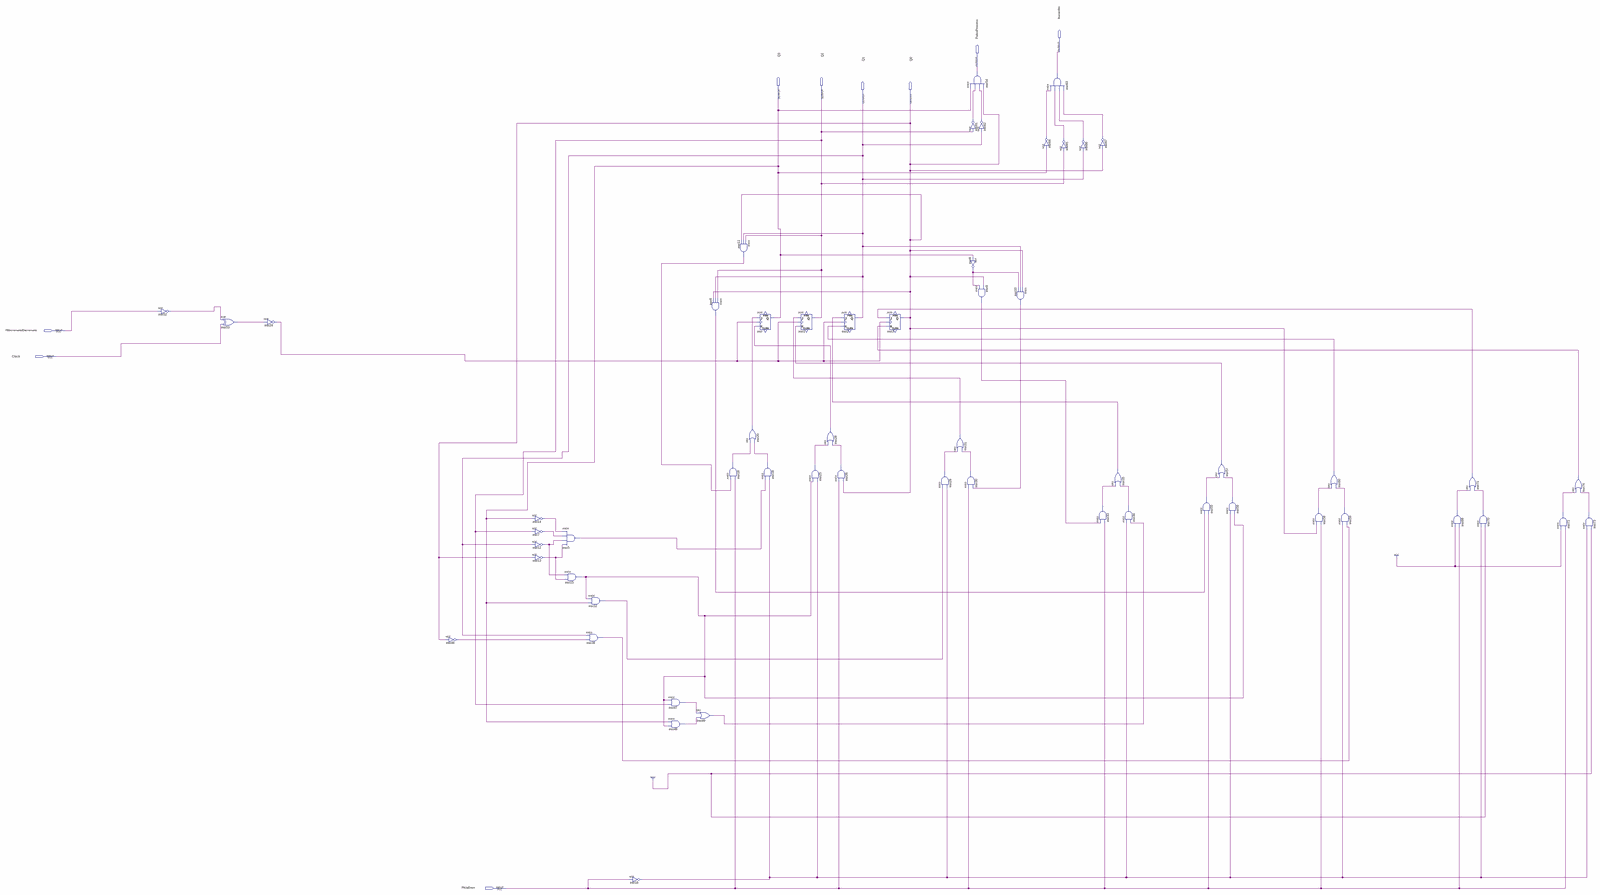
[diagram p0: schematic sheet, whole]
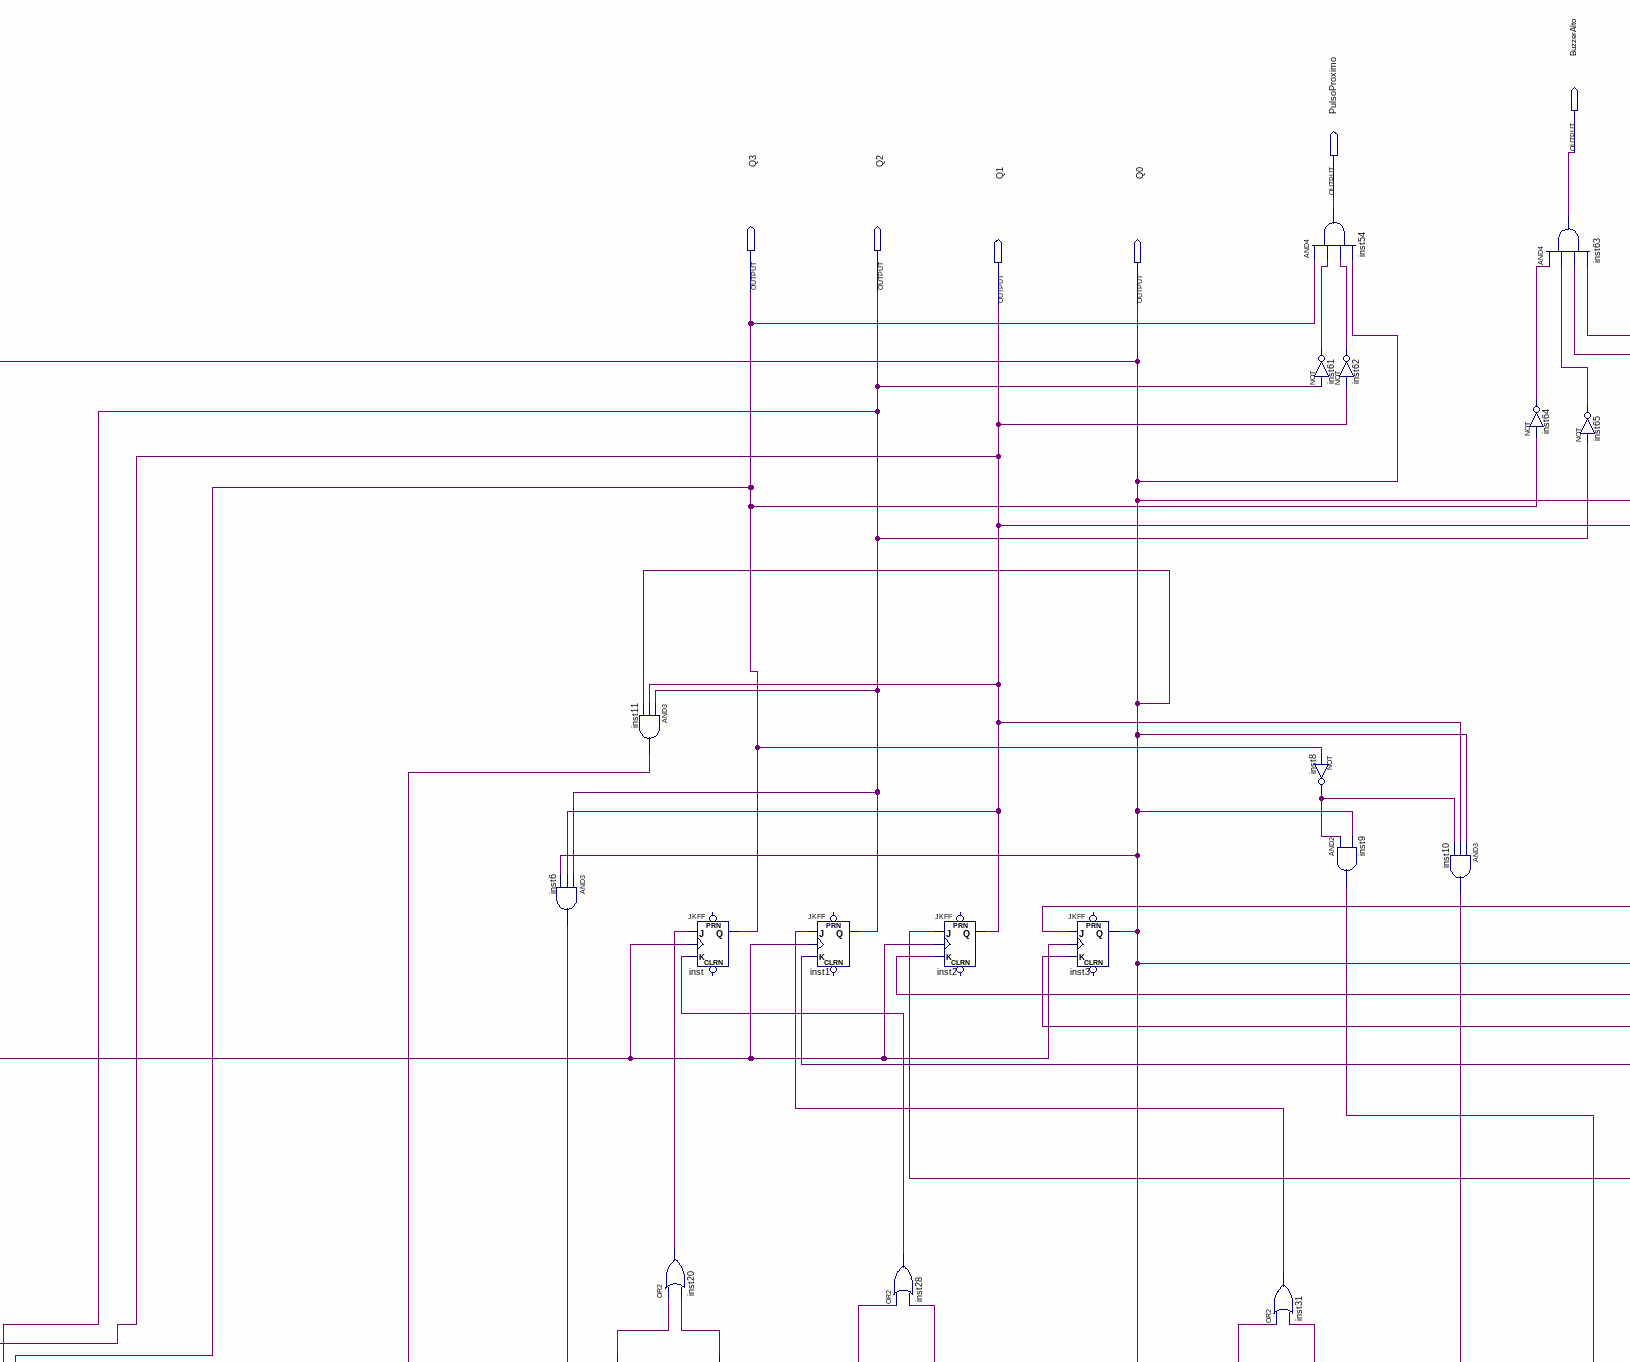
[diagram p1: schematic sheet, upper centre part]
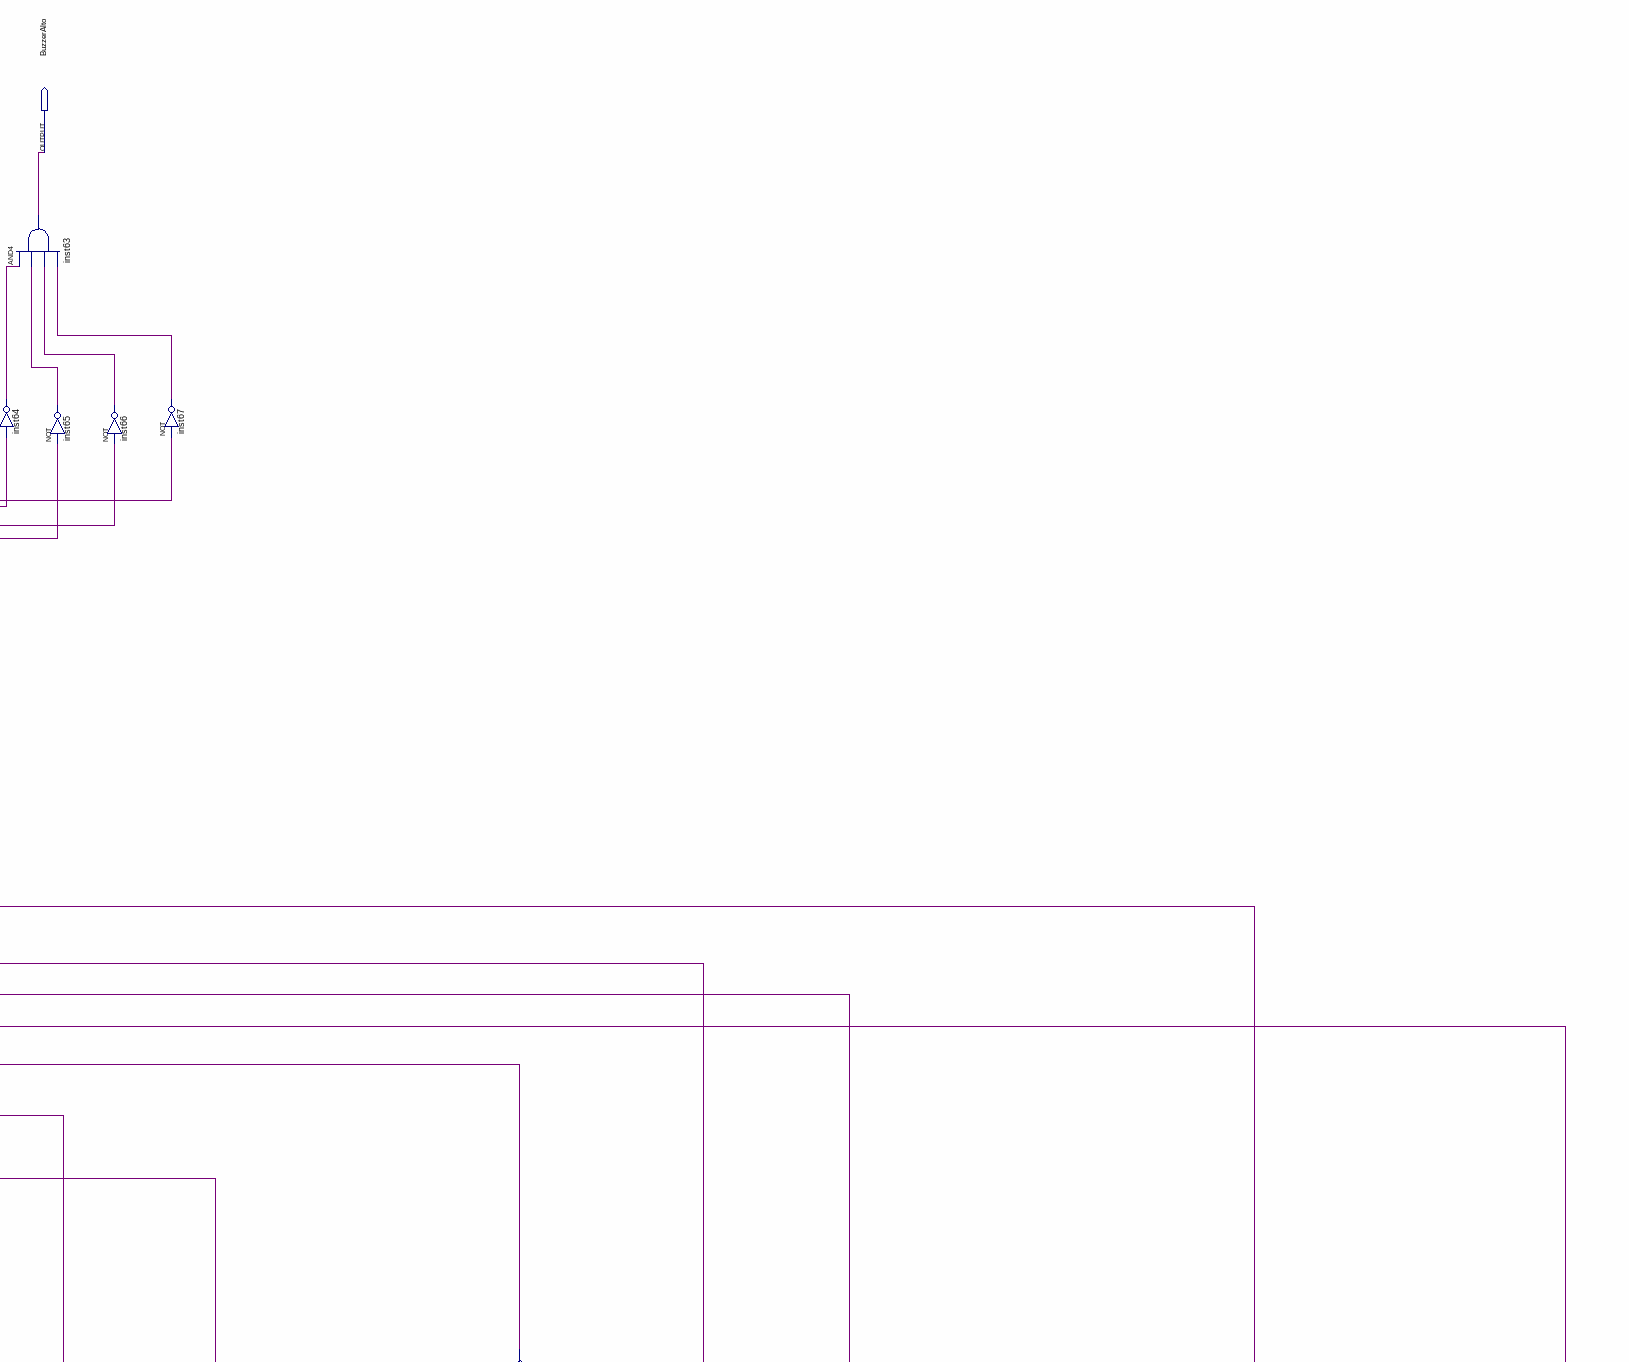
[diagram p2: schematic sheet, upper right part]
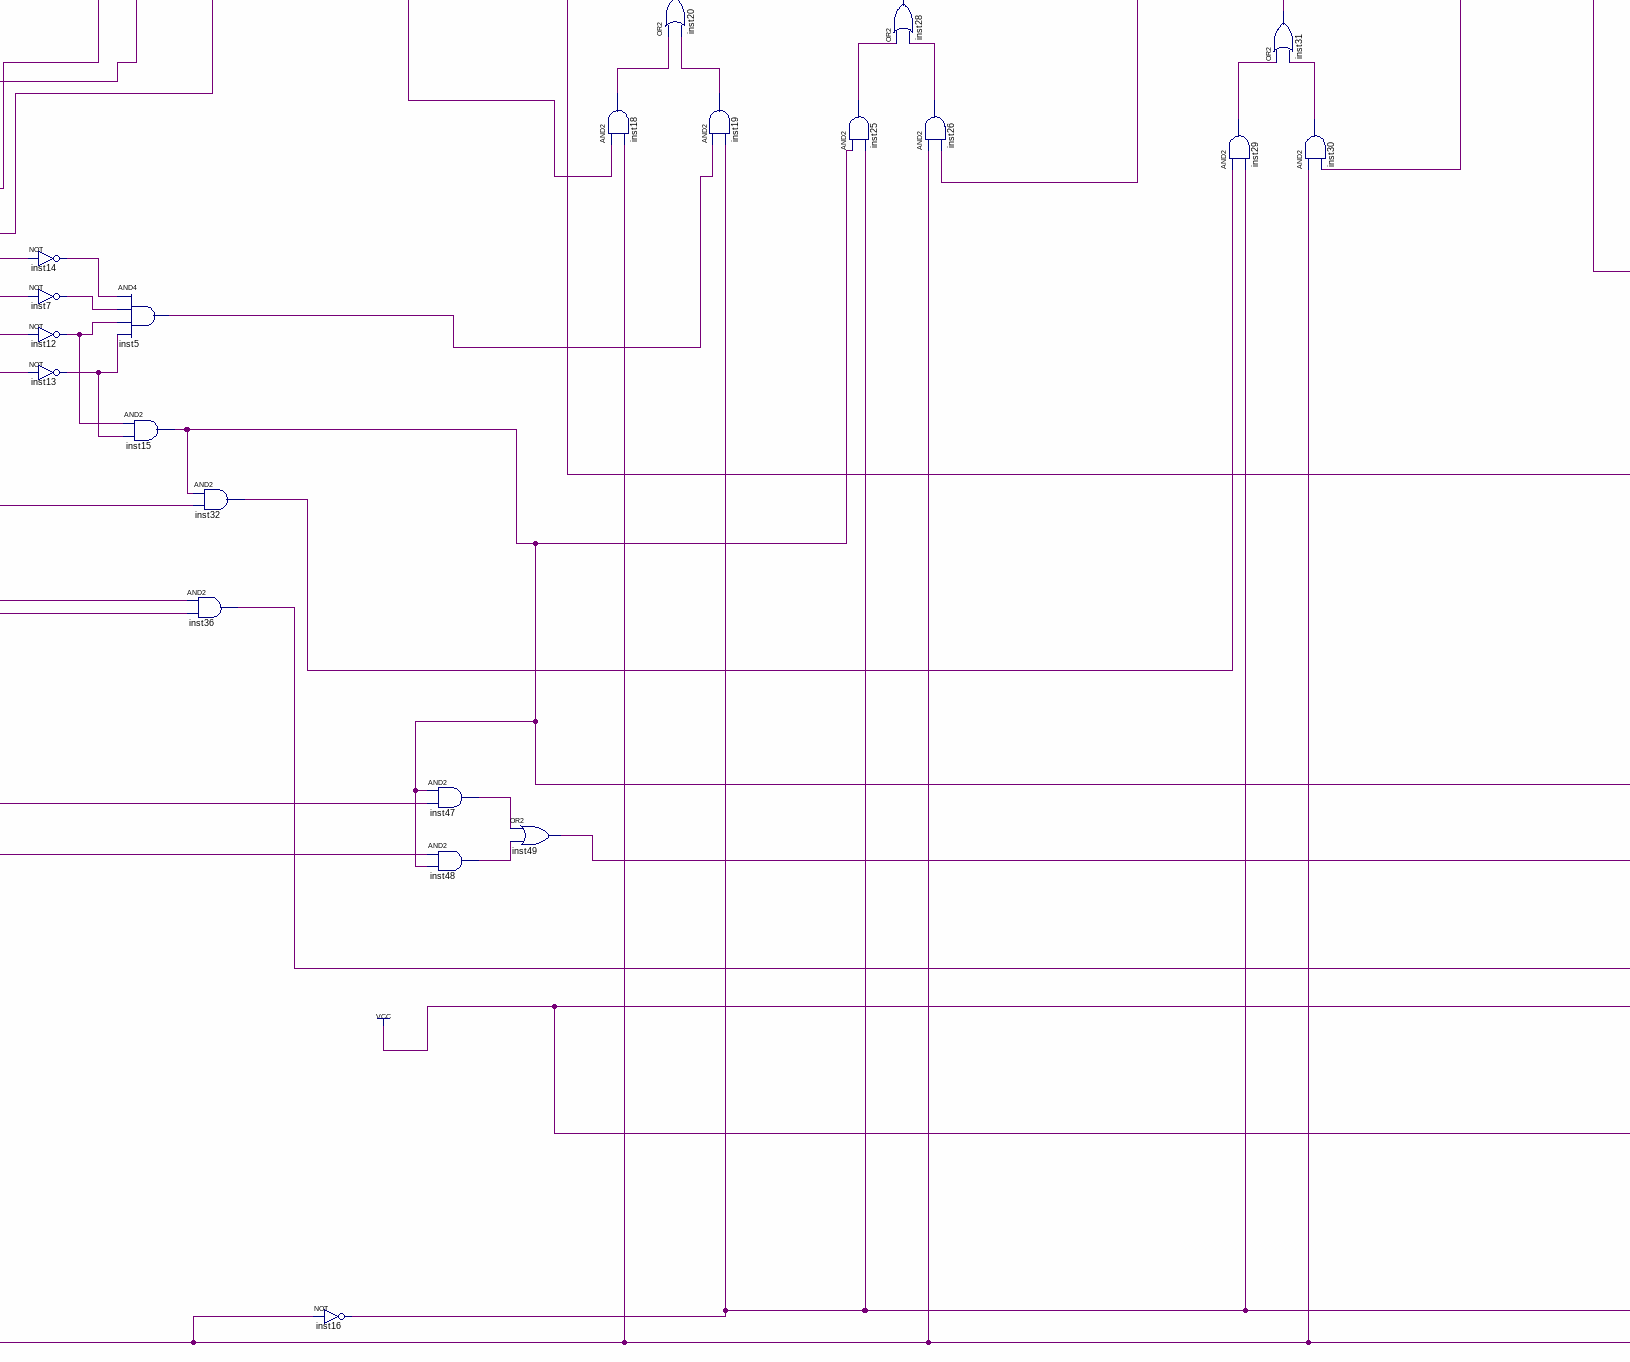
[diagram p3: schematic sheet, lower centre part]
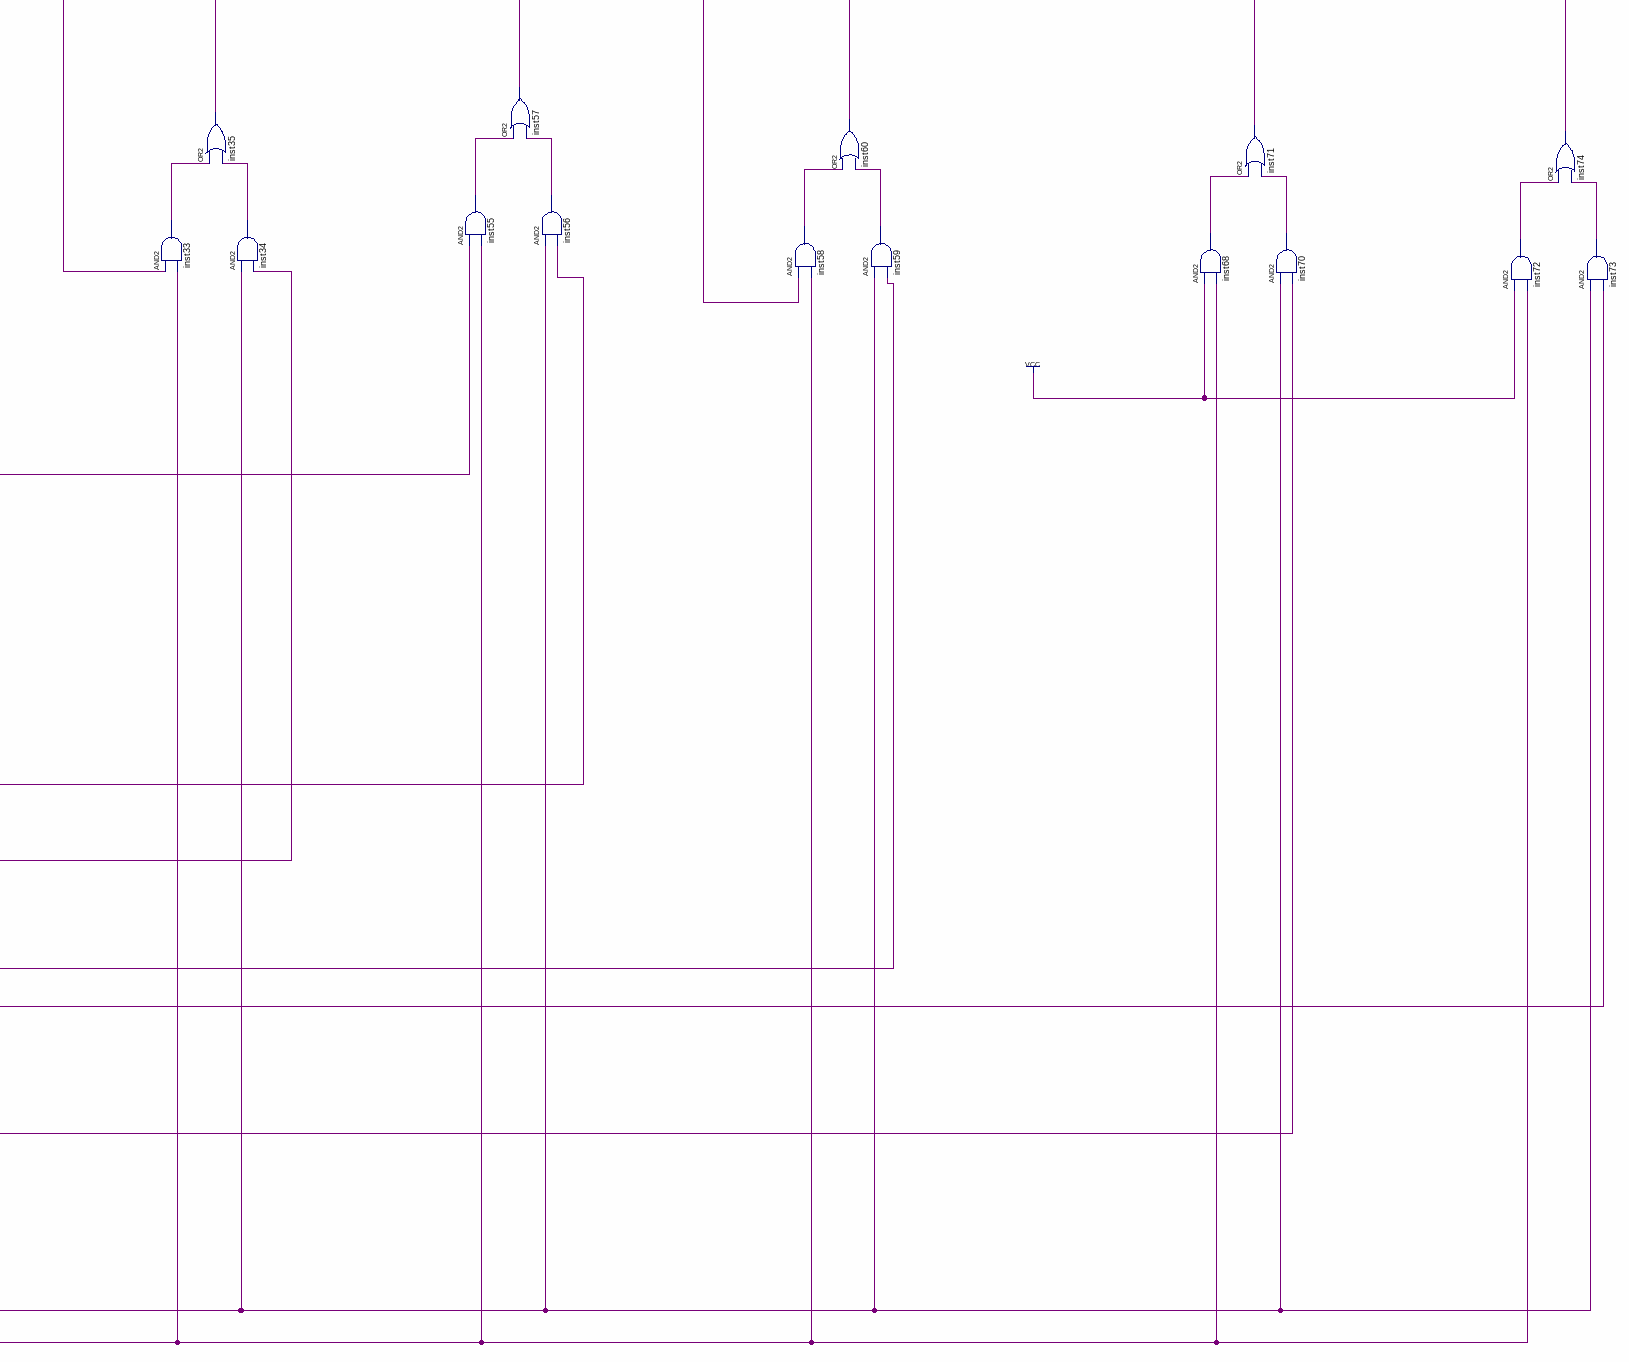
[diagram p4: schematic sheet, lower right part]
// Quartus schematic contador0a9v1.bdf as structural Verilog: 57 symbols, 9 pins
module contador0a9v1 (
  input  \PBIncremento/Decremento ,
  input  Clock,
  input  PbUpDown,
  output BuzzerAlto,
  output PulsoProximo,
  output Q3,
  output Q2,
  output Q1,
  output Q0
);

  wire inst5_out, inst6_out, inst7_out, inst8_out, inst9_out, inst10_out, inst11_out, inst12_out, inst13_out,
       inst14_out, inst15_out, inst16_out, inst18_out, inst19_out, inst20_out, inst24_out, inst25_out,
       inst26_out, inst28_out, inst29_out, inst30_out, inst31_out, inst32_out, inst33_out, inst34_out,
       inst35_out, inst36_out, inst46_out, inst47_out, inst48_out, inst49_out, inst52_out, inst53_out,
       inst55_out, inst56_out, inst57_out, inst58_out, inst59_out, inst60_out, inst61_out, inst62_out,
       inst64_out, inst65_out, inst66_out, inst67_out, inst68_out, inst70_out, inst71_out, inst72_out,
       inst73_out, inst74_out;

  not inst52 (inst52_out, \PBIncremento/Decremento );
  xor inst53 (inst53_out, inst52_out, Clock);
  not inst24 (inst24_out, inst53_out);
  not inst46 (inst46_out, Q0);
  not inst14 (inst14_out, Q3);
  not inst7 (inst7_out, Q2);
  not inst12 (inst12_out, Q1);
  not inst13 (inst13_out, Q0);
  and inst5 (inst5_out, inst14_out, inst7_out, inst12_out, inst13_out);
  and inst15 (inst15_out, inst12_out, inst13_out);
  and inst32 (inst32_out, inst15_out, Q3);
  and inst36 (inst36_out, Q1, inst46_out);
  not inst16 (inst16_out, PbUpDown);
  and inst47 (inst47_out, inst15_out, Q2);
  and inst48 (inst48_out, Q3, inst15_out);
  or inst49 (inst49_out, inst47_out, inst48_out);
  and inst6 (inst6_out, Q2, Q1, Q0);
  and inst18 (inst18_out, inst11_out, PbUpDown);
  and inst11 (inst11_out, Q2, Q1, Q0);
  or inst20 (inst20_out, inst18_out, inst19_out);
  JKFF inst (.K(inst28_out), .J(inst20_out), .CLK(inst24_out), .Q(Q3));  // open: PRN, CLRN
  and inst19 (inst19_out, inst5_out, inst16_out);
  JKFF inst1 (.K(inst57_out), .J(inst31_out), .CLK(inst24_out), .Q(Q2));  // open: PRN, CLRN
  and inst25 (inst25_out, inst15_out, inst16_out);
  or inst28 (inst28_out, inst25_out, inst26_out);
  and inst26 (inst26_out, PbUpDown, Q0);
  JKFF inst2 (.K(inst60_out), .J(inst35_out), .CLK(inst24_out), .Q(Q1));  // open: PRN, CLRN
  JKFF inst3 (.K(inst74_out), .J(inst71_out), .CLK(inst24_out), .Q(Q0));  // open: PRN, CLRN
  and inst29 (inst29_out, inst32_out, inst16_out);
  or inst31 (inst31_out, inst29_out, inst30_out);
  and inst54 (PulsoProximo, Q3, inst61_out, inst62_out, Q0);
  not inst61 (inst61_out, Q2);
  not inst62 (inst62_out, Q1);
  not inst8 (inst8_out, Q3);
  and inst9 (inst9_out, inst8_out, Q0);
  and inst30 (inst30_out, PbUpDown, inst10_out);
  and inst10 (inst10_out, Q0, Q1, inst8_out);
  and inst63 (BuzzerAlto, inst64_out, inst65_out, inst66_out, inst67_out);
  not inst64 (inst64_out, Q3);
  not inst65 (inst65_out, Q2);
  not inst66 (inst66_out, Q1);
  not inst67 (inst67_out, Q0);
  and inst33 (inst33_out, inst9_out, PbUpDown);
  or inst35 (inst35_out, inst33_out, inst34_out);
  and inst34 (inst34_out, inst16_out, inst49_out);
  and inst55 (inst55_out, inst6_out, PbUpDown);
  or inst57 (inst57_out, inst55_out, inst56_out);
  and inst56 (inst56_out, inst16_out, inst15_out);
  and inst58 (inst58_out, Q0, PbUpDown);
  or inst60 (inst60_out, inst58_out, inst59_out);
  and inst59 (inst59_out, inst16_out, inst36_out);
  and inst68 (inst68_out, 1'b1, PbUpDown);
  or inst71 (inst71_out, inst68_out, inst70_out);
  and inst70 (inst70_out, inst16_out, 1'b1);
  and inst72 (inst72_out, 1'b1, PbUpDown);
  or inst74 (inst74_out, inst72_out, inst73_out);
  and inst73 (inst73_out, inst16_out, 1'b1);
endmodule
